# EAGLE schematic main (EAGLE 9.0.0)
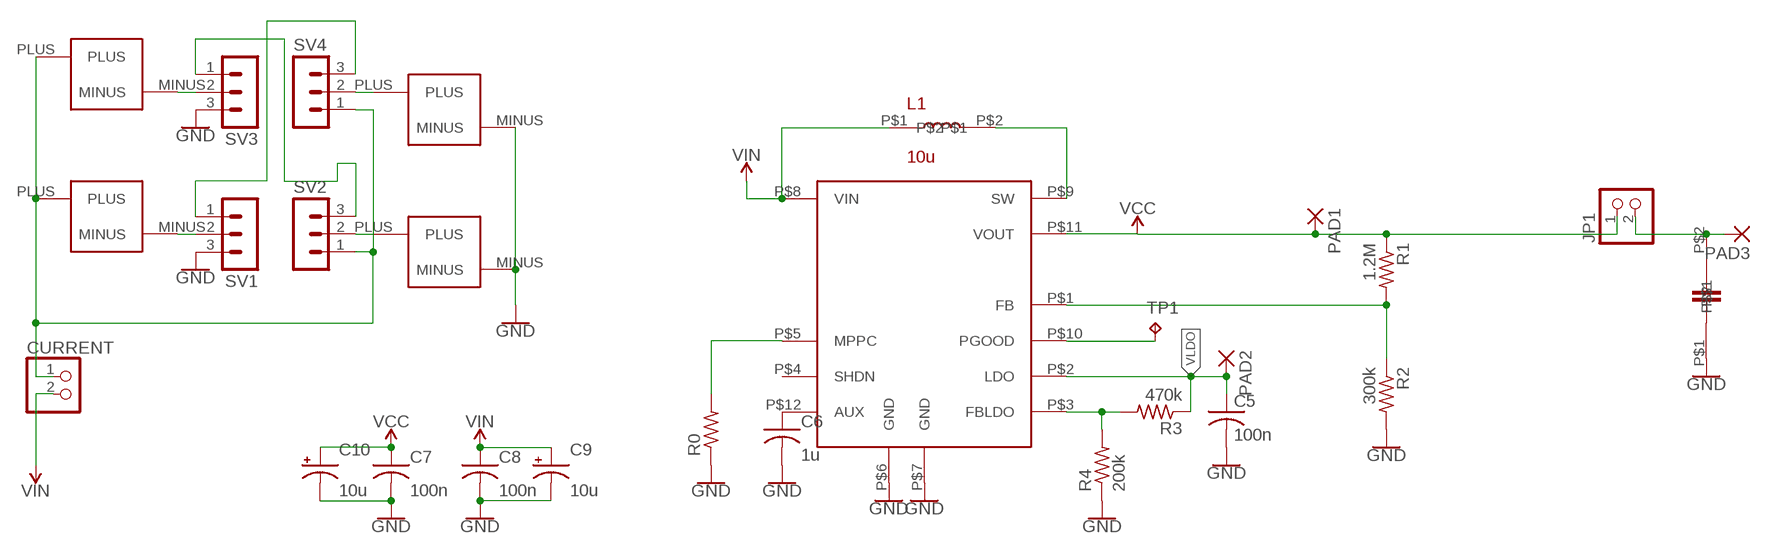
[diagram p0: schematic, sheet 1]

## Parts
C1  SOLAR_CELL  [SOLAR_CELL]
C2  SOLAR_CELL  [SOLAR_CELL]
C3  SOLAR_CELL  [SOLAR_CELL]
C4  SOLAR_CELL  [SOLAR_CELL]
C5  100n  C-USC0805K  [C0805K]
C6  1u  C-USC0805K  [C0805K]
C7  100n  C-USC0805K  [C0805K]
C8  100n  C-USC0805K  [C0805K]
C9  10u  CPOL-USCT3528  [CT3528]
C10  10u  CPOL-USCT3528  [CT3528]
CURRENT  PINHD-1X2  [1X02]
JP1  PINHD-1X2  [1X02]
L1  10u  DO1813H  [DO1813H]
PAD1  2,54/1,0  [2,54/1,0]
PAD2  2,54/1,0  [2,54/1,0]
PAD3  2,54/1,0  [2,54/1,0]
R0  R-US_R0603  [R0603]
R1  1.2M  R-US_R0603  [R0603]
R2  300k  R-US_R0603  [R0603]
R3  470k  R-US_R0603  [R0603]
R4  200k  R-US_R0603  [R0603]
SV1  MA03-1  [MA03-1]
SV2  MA03-1  [MA03-1]
SV3  MA03-1  [MA03-1]
SV4  MA03-1  [MA03-1]
TP1  TPTP11SQ  [TP11SQ]
U$1  LTC3105  [MSOP_12]
U$2  SUPERCAP  [SUPERCAP]

## Nets
GND: C2.MINUS C4.MINUS C5.2 C6.2 C7.2 C8.2 C9.- C10.- R0.1 R2.2 R4.1 SV1.3 SV3.3 U$1.P$6(GND) U$1.P$7(GND) U$2.P$1
N$1: C1.MINUS SV1.2
N$2: C3.MINUS SV3.2
N$3: C4.PLUS SV4.2
N$4: C2.PLUS SV2.2
N$5: SV2.3 SV3.1
N$6: SV1.1 SV4.3
N$7: TP1.TP U$1.P$10(PGOOD)
N$8: C6.1 U$1.P$12(AUX)
N$9: L1.P$2 U$1.P$9(SW)
N$10: R0.2 U$1.P$5(MPPC)
N$11: R3.2 R4.2 U$1.P$3(FBLDO)
N$13: R1.2 R2.1 U$1.P$1(FB)
N$14: C1.PLUS C3.PLUS CURRENT.1 SV2.1 SV4.1
N$15: JP1.2 PAD3.1(P) U$2.P$2
VCC: C7.1 C10.+ JP1.1 PAD1.1(P) R1.1 U$1.P$11(VOUT)
VIN: C8.1 C9.+ CURRENT.2 L1.P$1 U$1.P$8(VIN)
VLDO: C5.1 PAD2.1(P) R3.1 U$1.P$2(LDO)
Unconnected: U$1.P$4(SHDN)

## Library data of the parts
C1-C4 = 7_segment_lib:SOLAR_CELL
C5-C8 = rcl:C-US: CAPACITOR, American symbol; SPICEPREFIX: C
C9 C10 = rcl:CPOL-US: POLARIZED CAPACITOR, American symbol; SPICEPREFIX: C
CURRENT JP1 = pinhead:PINHD-1X2: PIN HEADER
L1 = 7_segment_lib:DO1813H
PAD1-PAD3 = 7_segment_lib:2,54/1,0: THROUGH-HOLE PAD
R0 R1-R4 = resistor:R-US_: RESISTOR, American symbol
SV1-SV4 = con-lstb:MA03-1: PIN HEADER; OC_FARNELL: unknown; OC_NEWARK: unknown
TP1 = testpad:TP: Test pad
U$1 = 7_segment_lib:LTC3105
U$2 = 7_segment_lib:SUPERCAP